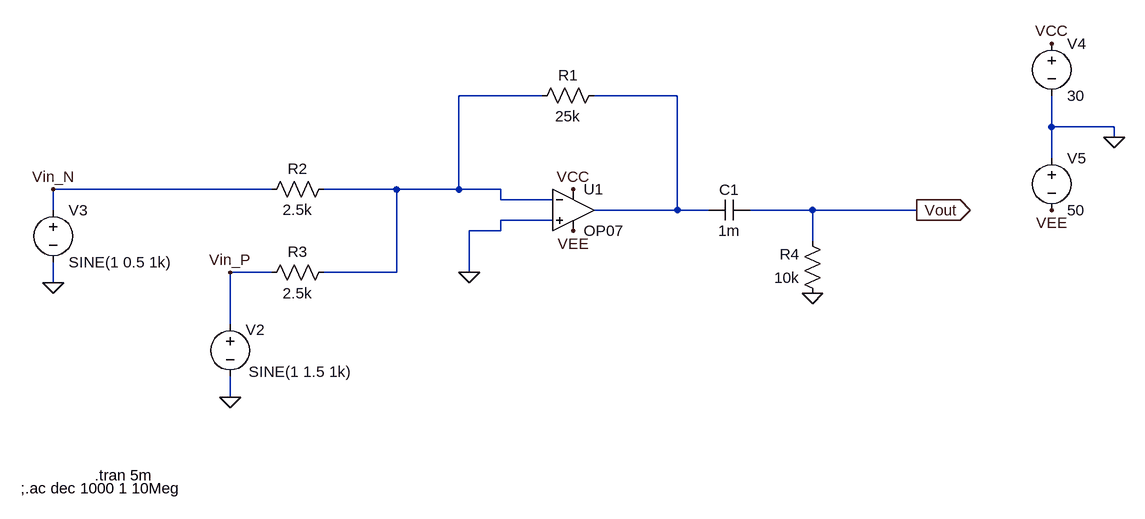
[diagram p0: schematic OPamp_adder.asc]
OPamp_adder.asc, the LTspice schematic file:
Version 4
SHEET 1 1188 680
WIRE 288 -144 160 -144
WIRE 496 -144 368 -144
WIRE 1072 -96 1072 -144
WIRE 1168 -96 1072 -96
WIRE 1168 -80 1168 -96
WIRE 1072 -48 1072 -96
WIRE -128 0 -464 0
WIRE 64 0 -48 0
WIRE 160 0 160 -144
WIRE 160 0 64 0
WIRE 224 0 160 0
WIRE 224 16 224 0
WIRE 304 16 224 16
WIRE -464 32 -464 0
WIRE 496 32 496 -144
WIRE 496 32 368 32
WIRE 544 32 496 32
WIRE 704 32 608 32
WIRE 864 32 704 32
WIRE 304 48 224 48
WIRE 224 64 224 48
WIRE 224 64 176 64
WIRE 704 80 704 32
WIRE -128 128 -192 128
WIRE 64 128 64 0
WIRE 64 128 -48 128
WIRE 176 128 176 64
WIRE -464 144 -464 112
WIRE -192 208 -192 128
WIRE -192 320 -192 288
FLAG 864 32 Vout
IOPIN 864 32 Out
FLAG 1168 -80 0
FLAG 1072 -224 VCC
FLAG 336 0 VCC
FLAG 1072 32 VEE
FLAG 336 64 VEE
FLAG -464 144 0
FLAG -192 320 0
FLAG 176 128 0
FLAG 704 160 0
FLAG -464 0 Vin_N
FLAG -192 128 Vin_P
SYMBOL res 384 -160 R90
WINDOW 0 0 56 VBottom 2
WINDOW 3 32 56 VTop 2
SYMATTR InstName R1
SYMATTR Value 25k
SYMBOL res -32 -16 R90
WINDOW 0 0 56 VBottom 2
WINDOW 3 32 56 VTop 2
SYMATTR InstName R2
SYMATTR Value 2.5k
SYMBOL res -32 112 R90
WINDOW 0 0 56 VBottom 2
WINDOW 3 32 56 VTop 2
SYMATTR InstName R3
SYMATTR Value 2.5k
SYMBOL voltage -192 192 R0
WINDOW 0 24 24 Left 2
WINDOW 3 29 89 Left 2
WINDOW 123 0 0 Left 0
WINDOW 39 0 0 Left 0
SYMATTR InstName V2
SYMATTR Value SINE(1 1.5 1k)
SYMBOL voltage -464 16 R0
WINDOW 123 0 0 Left 0
WINDOW 39 0 0 Left 0
SYMATTR InstName V3
SYMATTR Value SINE(1 0.5 1k)
SYMBOL Opamps\\OP07 336 -32 R0
SYMATTR InstName U1
SYMBOL voltage 1072 -240 R0
WINDOW 123 0 0 Left 0
WINDOW 39 0 0 Left 0
SYMATTR InstName V4
SYMATTR Value 30
SYMBOL voltage 1072 -64 R0
WINDOW 123 0 0 Left 0
WINDOW 39 0 0 Left 0
SYMATTR InstName V5
SYMATTR Value 50
SYMBOL res 720 176 R180
WINDOW 0 36 76 Left 2
WINDOW 3 36 40 Left 2
SYMATTR InstName R4
SYMATTR Value 10k
SYMBOL cap 608 16 R90
WINDOW 0 0 32 VBottom 2
WINDOW 3 32 32 VTop 2
SYMATTR InstName C1
SYMATTR Value 1m
TEXT -400 440 Left 2 !.tran 5m
TEXT -514 460 Left 2 !;.ac dec 1000 1 10Meg

The netlist it stands for:
* OPamp_adder.asc
R1 N002 N001 25k
R2 N001 Vin_N 2.5k
R3 N001 Vin_P 2.5k
V2 Vin_P 0 SINE(1 1.5 1k)
V3 Vin_N 0 SINE(1 0.5 1k)
XU1 0 N001 VCC VEE N002 LT1001  ; OP07, pins In+ In- V+ V- OUT
V4 VCC 0 30
V5 0 VEE 50
R4 0 Vout 10k
C1 Vout N002 1m
.tran 5m
;.ac dec 1000 1 10Meg
.lib LTC.lib
.backanno
.end